# Altium project US-Plus-CPM.PrjPcb (part 2 of 2)

## Sheet Interfaces.SchDoc
size A3; DocumentNumber: 8; SheetNumber: 8; SheetTotal: 9; PageSetup: Record=PageOptions|CenterHorizontal=True|CenterVertical=True|PrintScale=0.97|XCorrection=1.00|YCorrection=1.00|PrintKind=1|BorderSize=5000000|LeftOffset=0|BottomOffset=0|Orientation=2|PaperLength=2970|PaperWidth=2100|Scale=100|PaperSource=7|PrintQuality=600|MediaType=1|DitherType=10|PaperKind=A4|PrintScaleMode=1
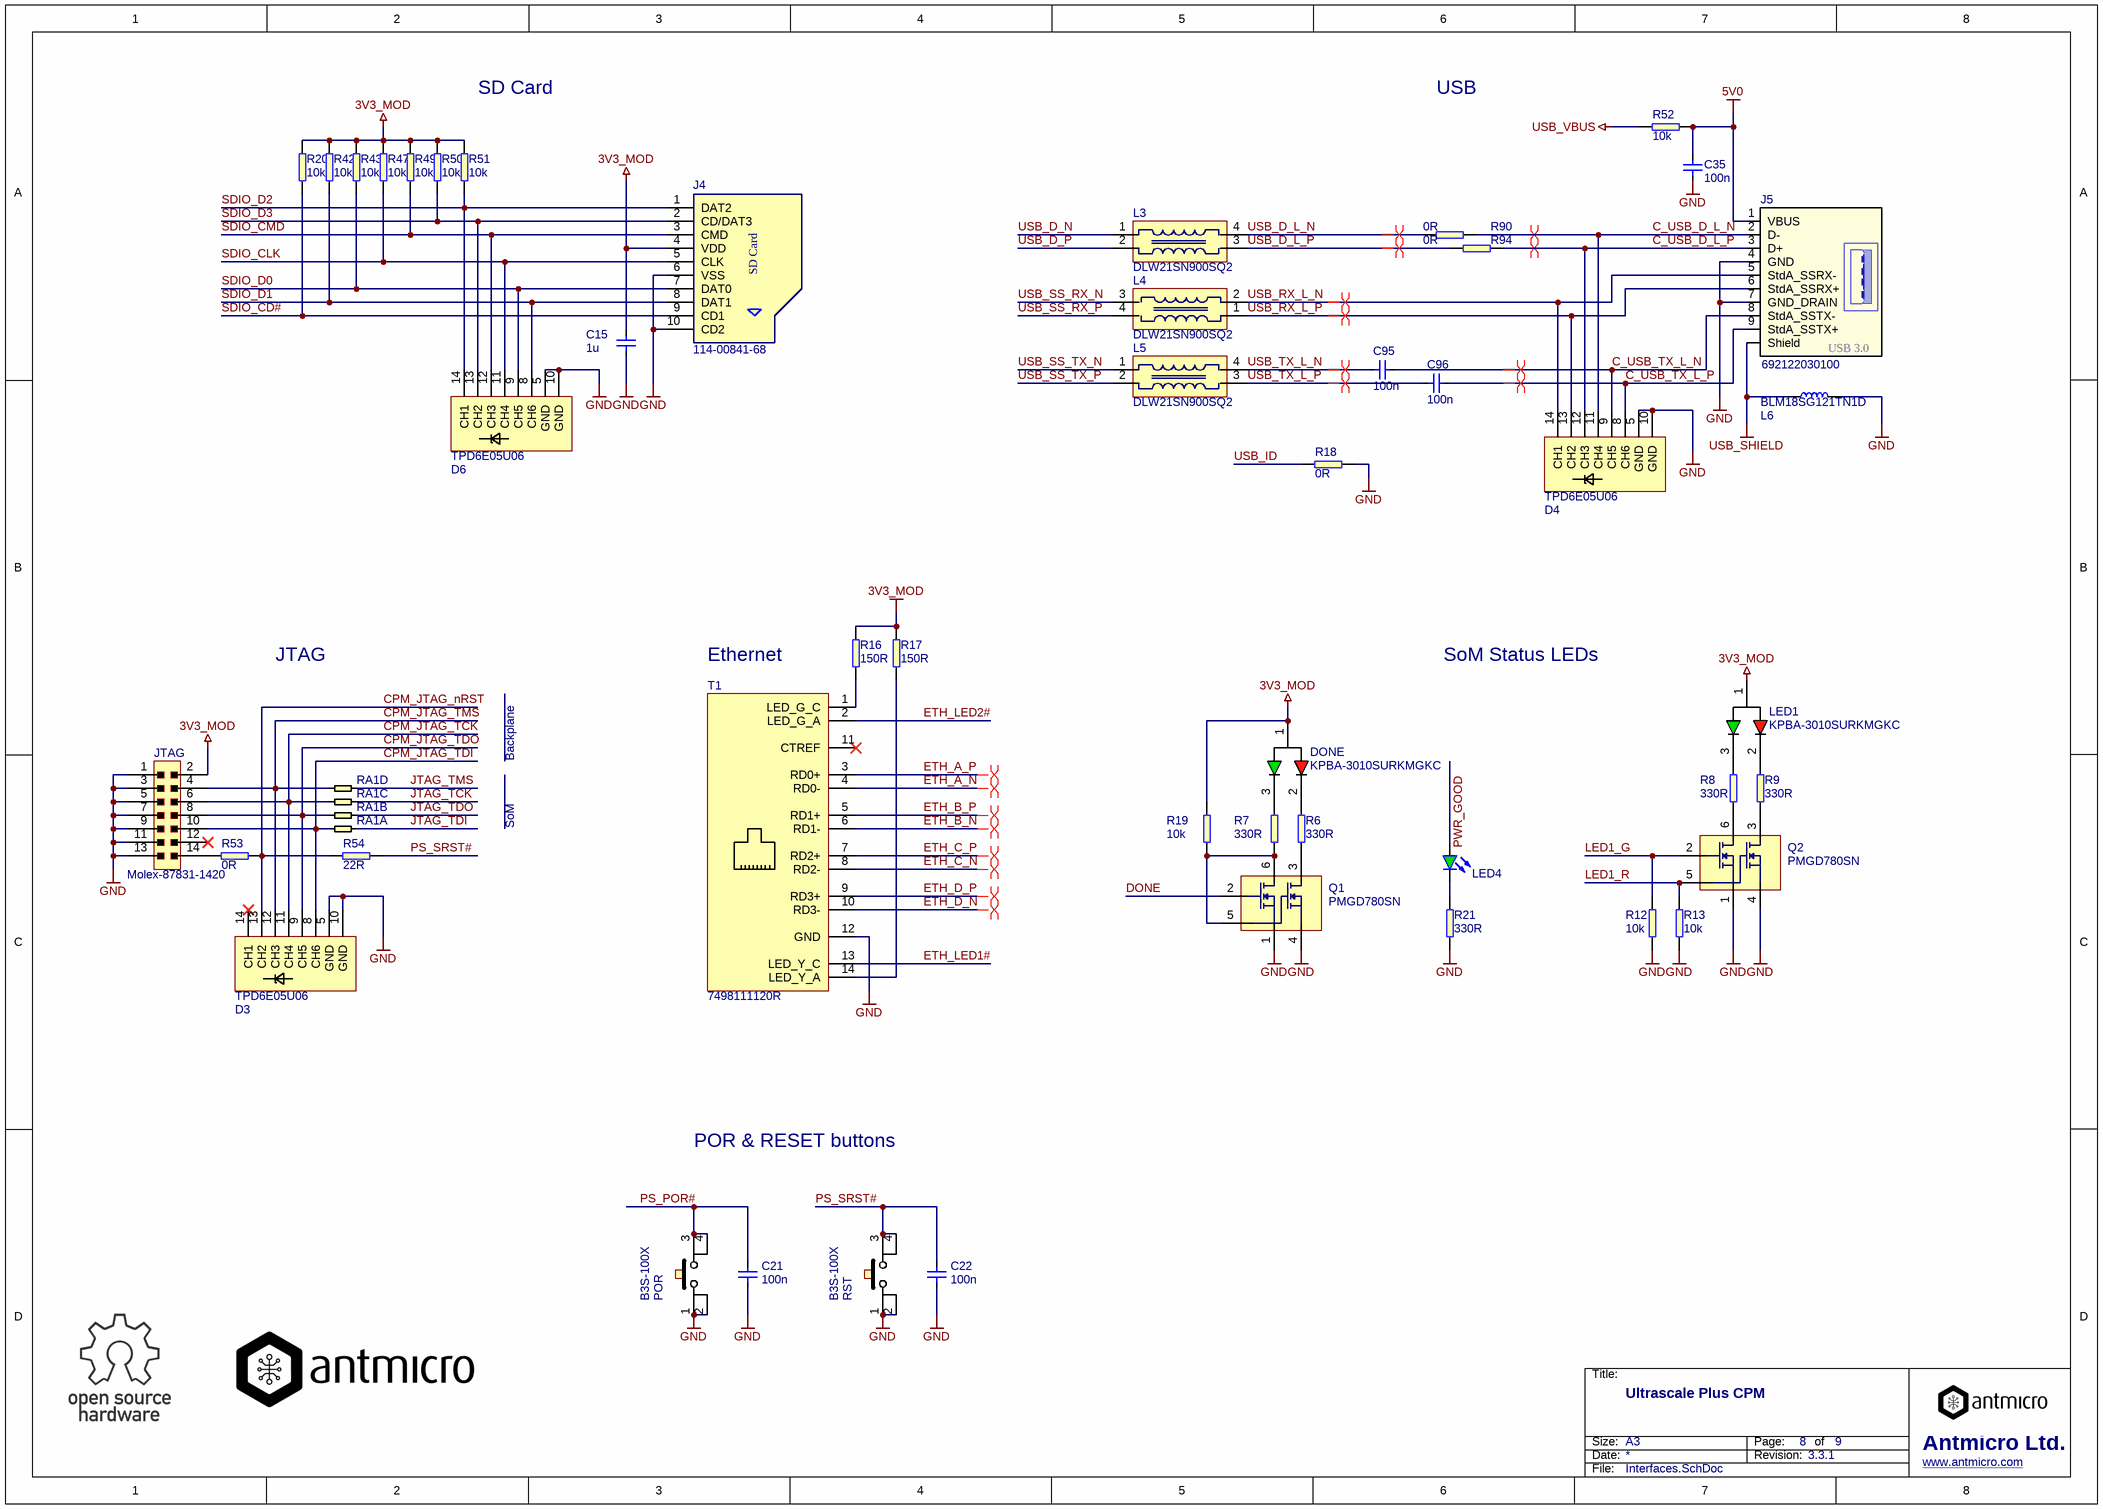
[diagram p7: Interfaces.SchDoc]

### Parts
C15  1u  [0603]
C21  100n  [0603]
C22  100n  [0603]
C35  100n  [0402]
C95  100n  [0402]
C96  100n  [0402]
D3  TPD6E05U06  [TPD6E05U06_PASS]
D4  TPD6E05U06  [TPD6E05U06_PASS]
D6  TPD6E05U06  [TPD6E05U06_PASS]
DONE  KPBA-3010SURKMGKC  [3010SURKMGKC]
J4  114-00841-68  [114-00841-68]
J5  692122030100  [WE_692122030100]
JTAG  Molex-87831-1420  [CON-Molex-87831-1420]
L3  DLW21SN900SQ2  [DLW21SN900SQ2]
L4  DLW21SN900SQ2  [DLW21SN900SQ2]
L5  DLW21SN900SQ2  [DLW21SN900SQ2]
L6  BLM18SG121TN1D  [0603]
LED1  KPBA-3010SURKMGKC  [3010SURKMGKC]
LED4  KPT-1608SGC  [LED0603]  (value not drawn)
POR  B3S-100X  [B3S-100X]
Q1  PMGD780SN  [SOT-363]
Q2  PMGD780SN  [SOT-363]
R6  330R  [0603]
R7  330R  [0603]
R8  330R  [0402]
R9  330R  [0402]
R12  10k  [0402]
R13  10k  [0402]
R16  150R  [0603]
R17  150R  [0603]
R18  0R  [0603]
R19  10k  [0603]
R20  10k  [0402]
R21  330R  [0603]
R42  10k  [0402]
R43  10k  [0402]
R47  10k  [0402]
R49  10k  [0402]
R50  10k  [0402]
R51  10k  [0402]
R52  10k  [0603]
R53  0R  [0603]
R54  22R  [0603]
R90  0R  [0402]
R94  0R  [0402]
RA1  22R  [RA_1206]  (value not drawn)  (parts A,B,C,D of 4)
RST  B3S-100X  [B3S-100X]
T1  7498111120R  [7498111120R]

### Nets
3V3_MOD: C15.2 DONE.1(CA) J4.4(VDD) JTAG.2 LED1.1(CA) R16.2 R17.2 R19.2 R20.2 R42.2 R43.2 R47.2 R49.2 R50.2 R51.2
5V0: C35.2 J5.1(VBUS) R52.2
GND: C15.1 C21.1 C22.1 C35.1 D3.5(GND) D3.10(GND) D4.5(GND) D4.10(GND) D6.5(GND) D6.10(GND) J4.6(VSS) J4.10(CD2) J5.4(GND) J5.7(GND_DRAIN) JTAG.1 JTAG.3 JTAG.5 JTAG.7 JTAG.9 JTAG.11 JTAG.13 L6.2 POR.1 POR.2 Q1.1(S1) Q1.4(S2) Q2.1(S1) Q2.4(S2) R12.1 R13.1 R18.2 R21.2 RST.1 RST.2 T1.12(GND)
USB_SHIELD: J5.Z1(Shield) L6.1
USB_VBUS: R52.1
C_USB_D_L_N: D4.11(CH4) J5.2(D-) R90.2
C_USB_D_L_P: D4.12(CH3) J5.3(D+) R94.2
C_USB_TX_L_N: C95.2 D4.9(CH5) J5.8(StdA_SSTX-)
C_USB_TX_L_P: C96.2 D4.8(CH6) J5.9(StdA_SSTX+)
CPM_JTAG_nRST: D3.13(CH2) R53.2 R54.1
CPM_JTAG_TCK: D3.11(CH4) JTAG.6 RA1.3
CPM_JTAG_TDI: D3.8(CH6) JTAG.10 RA1.1
CPM_JTAG_TDO: D3.9(CH5) JTAG.8 RA1.2
CPM_JTAG_TMS: D3.12(CH3) JTAG.4 RA1.4
DONE: Q1.2(G1)
ETH_A_N: T1.4(RD0-)
ETH_A_P: T1.3(RD0+)
ETH_B_N: T1.6(RD1-)
ETH_B_P: T1.5(RD1+)
ETH_C_N: T1.8(RD2-)
ETH_C_P: T1.7(RD2+)
ETH_D_N: T1.10(RD3-)
ETH_D_P: T1.9(RD3+)
ETH_LED1#: T1.13(LED_Y_C)
ETH_LED2#: T1.2(LED_G_A)
JTAG_TCK: RA1.7
JTAG_TDI: RA1.5
JTAG_TDO: RA1.6
JTAG_TMS: RA1.8
LED1_G: Q2.2(G1) R12.2
LED1_R: Q2.5(G2) R13.2
PS_POR#: C21.2 POR.3 POR.4
PS_SRST#: C22.2 R54.2 RST.3 RST.4
PWR_GOOD: LED4.A
SDIO_CD#: J4.9(CD1) R20.1
SDIO_CLK: D6.11(CH4) J4.5(CLK) R47.1
SDIO_CMD: D6.12(CH3) J4.3(CMD) R49.1
SDIO_D0: D6.9(CH5) J4.7(DAT0) R43.1
SDIO_D1: D6.8(CH6) J4.8(DAT1) R42.1
SDIO_D2: D6.14(CH1) J4.1(DAT2) R51.1
SDIO_D3: D6.13(CH2) J4.2(CD/DAT3) R50.1
USB_D_L_N: L3.4 R90.1
USB_D_L_P: L3.3 R94.1
USB_D_N: L3.1
USB_D_P: L3.2
USB_ID: R18.1
USB_RX_L_N: D4.14(CH1) J5.5(StdA_SSRX-) L4.2
USB_RX_L_P: D4.13(CH2) J5.6(StdA_SSRX+) L4.1
USB_SS_RX_N: L4.3
USB_SS_RX_P: L4.4
USB_SS_TX_N: L5.1
USB_SS_TX_P: L5.2
USB_TX_L_N: C95.1 L5.4
USB_TX_L_P: C96.1 L5.3
NetDONE_2: DONE.2(R_K) R6.1
NetDONE_3: DONE.3(G_K) R7.1
NetJTAG_14: JTAG.14 R53.1
NetLED1_2: LED1.2(R_K) R9.2
NetLED1_3: LED1.3(G_K) R8.2
NetLED4_K: LED4.K R21.1
NetQ1_3: Q1.3(D2) R6.2
NetQ1_5: Q1.5(G2) Q1.6(D1) R7.2 R19.1
NetQ2_3: Q2.3(D2) R9.1
NetQ2_6: Q2.6(D1) R8.1
NetR16_1: R16.1 T1.1(LED_G_C)
NetR17_1: R17.1 T1.14(LED_Y_A)

Not connected (* = marked no-connect by the designer): D3 14(CH1)*; JTAG 12*; T1 11(CTREF)*

### Layout directives
differential pair: C_USB_D_L_N, C_USB_D_L_P, C_USB_TX_L_N, C_USB_TX_L_P, ETH_A_N, ETH_A_P, ETH_B_N, ETH_B_P, ETH_C_N, ETH_C_P, ETH_D_N, ETH_D_P, USB_D_L_N, USB_D_L_P, USB_RX_L_N, USB_RX_L_P, USB_TX_L_N, USB_TX_L_P

### Notes on the sheet
- SD Card
- USB
- JTAG
- Ethernet
- SoM Status LEDs
- Backplane
- SoM
- POR & RESET buttons
- Title:
- Size:
- Date:
- A3
- Revision:
- Page:
- of
- Antmicro Ltd.
- File:
- www.antmicro.com
- (in symbol AMP-114-00841-68) SD Card
- (in symbol WE_692122030100) USB 3.0

### Library data of the parts
C15 = C_1u_0603: MLCC SMT Capacitor 1uF 0603; Manufacturer: MULTICOMP; MPN: MC0603X105M6R3CT; Value: 1u; Part Number: C_1u_0603
C21 C22 = C_100n_0603: as C28 on sheet Display-Port; Value: 100n; Part Number: C_100n_0603
C35 C95 C96 = C_100n_0402: as C1 on sheet Backplane-Connector; Part Number: C_100n_0402; Value: 100n
D3 D4 D6 = TPD6E05U06_PASS: ESD Suppressors 6-CH Pass through layout; Manufacturer: Texas Instruments; MPN: TPD6E05U06RVZR; Part Number: TPD6E05U06_PASS; Value: TPD6E05U06
DONE LED1 = KPBA-3010SURKMGKC: LED SMD 1104 red/green 3x1mm 140° Lens: transparent; Manufacturer: Kingbright; Part Number: KPBA-3010SURKMGKC; Value: KPBA-3010SURKMGKC; MPN: KPBA-3010SURKMGKC
J4 = AMP-114-00841-68: Micro SD card holder; Manufacturer: AMPHENOL COMMERCIAL PRODUCTS; Part Number: AMP-114-00841-68; Value: 114-00841-68; MPN: 114-00841-68
J5 = WE_692122030100: Manufacturer: WURTH ELEKTRONIK; Part Number: WE_692122030100; Value: 692122030100; MPN: 692122030100
JTAG = CON-Molex-87831-1420: HEADER, SQUARE PIN, M/GRID, 14WAY; Manufacturer: MOLEX; Part Number: CON-Molex-87831-1420; Value: Molex-87831-1420; MPN: 87831-1420
L3-L5 = DLW21SN900SQ2: Common mode choke; Manufacturer: MURATA; MPN: DLW21SN900SQ2L; Part Number: DLW21SN900SQ2; Value: DLW21SN900SQ2
L6 = BLM18SG121TN1D: as L9 on sheet Debug; Part Number: BLM18SG121TN1D; Value: BLM18SG121TN1D; MPN: BLM18SG121TN1D
LED4 = LED_G: LED Green 0603 case; Part Number: LED_G; Manufacturer: KINGBRIGHT; Value: KPT-1608SGC; MPN: KPT-1608SGC
POR RST = B3S-100X: Manufacturer: OMRON; MPN: B3S-1002; Part Number: B3S-100X; Value: B3S-100X
Q1 Q2 = PMGD780SN: 60 V, dual N-channel Trench MOSFET; Manufacturer: NXP; MPN: PMGD780SN,115; Part Number: PMGD780SN; Value: PMGD780SN
R6 R7 R21 = R_330R_0603: SMT Resistor 330R 0603; Manufacturer: BOURNS; MPN: CR0603-FX-3300GLF; Value: 330R; Part Number: R_330R_0603
R8 R9 = R_330R_0402: SMT Resistor 0402; Manufacturer: MULTICOMP; MPN: MCMR04X3300FTL; Value: 330R; Part Number: R_330R_0402
R12 R13 R20 R42 R43 R47 R49-R51 = R_10k_0402: as R93 on sheet Debug; Value: 10k; Part Number: R_10k_0402
R16 R17 = R_150R_0603: SMT Resistor 150R 0603; Manufacturer: MULTICOMP; MPN: MC0063W06031150R; Value: 150R; Part Number: R_150R_0603
R18 R53 = R_0R_0603: SMT Resistor 0R 0603; Manufacturer: BOURNS; MPN: CR0603-J/-000ELF; Value: 0R; Part Number: R_0R_0603
R19 R52 = R_10k_0603: SMT Resistor 10k 0603; Manufacturer: BOURNS; MPN: CR0603-JW-103ELF; Value: 10k; Part Number: R_10k_0603
R54 = R_22R_0603: SMT Resistor 22R 0603; Manufacturer: BOURNS; MPN: CR0603-JW-220GLF; Value: 22R; Part Number: R_22R_0603
R90 R94 = R_0R_0402: as R44 on sheet Backplane-Connector; Part Number: R_0R_0402; Value: 0R
RA1 = RA-22R-63mW-5%-1206: YAGEO (PHYCOMP)  TC164-JR-0722RL  RESISTOR ARRAY, ARC241 1206 22R; Part Number: RA-22R-63mW-5%-1206; Value: 22R; Manufacturer: YAGEO (PHYCOMP); MPN: TC164-JR-0722RL
T1 = WE_7498111120R: LAN transformer 1000Base-T; Manufacturer: WURTH ELEKTRONIK; Part Number: WE_7498111120R; Value: 7498111120R; MPN: 7498111120R

## Sheet HDMI.SchDoc
size A3; DocumentNumber: 9; SheetNumber: 9; SheetTotal: 9; PageSetup: Record=PageOptions|CenterHorizontal=True|CenterVertical=True|PrintScale=0.97|XCorrection=1.00|YCorrection=1.00|PrintKind=1|BorderSize=5000000|LeftOffset=0|BottomOffset=0|Orientation=2|PaperLength=2970|PaperWidth=2100|Scale=100|PaperSource=7|PrintQuality=600|MediaType=1|DitherType=10|PaperKind=A4|PrintScaleMode=1
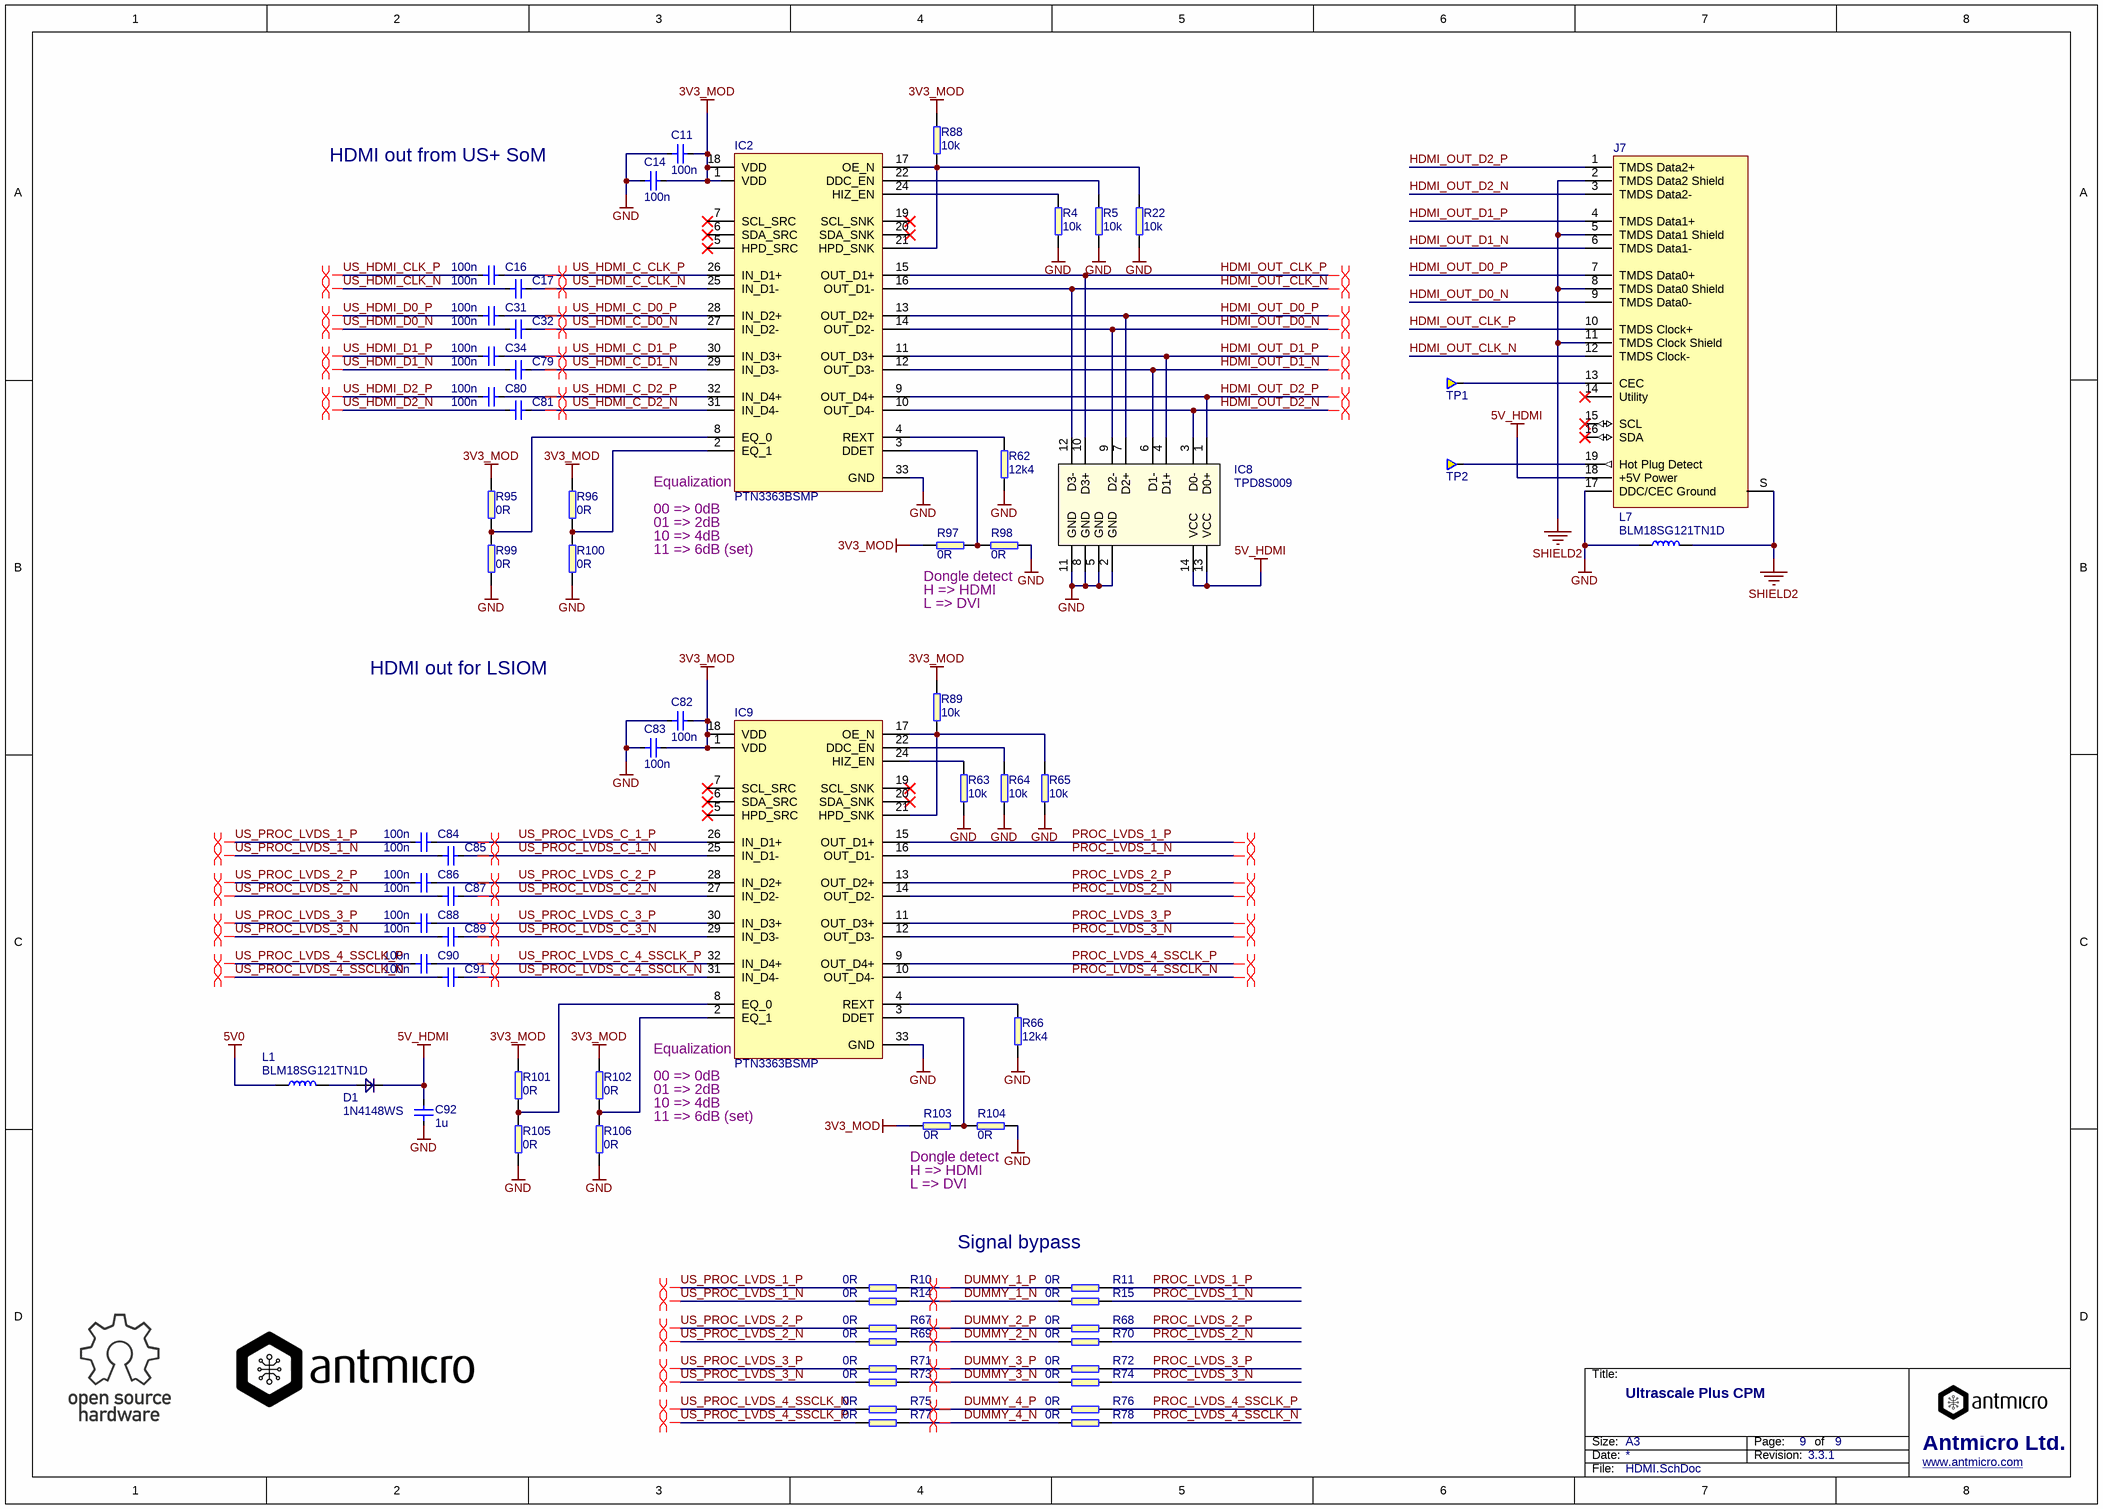
[diagram p8: HDMI.SchDoc]

### Parts
C11  100n  [0603]
C14  100n  [0603]
C16  100n  [0402]
C17  100n  [0402]
C31  100n  [0402]
C32  100n  [0402]
C34  100n  [0402]
C79  100n  [0402]
C80  100n  [0402]
C81  100n  [0402]
C82  100n  [0603]
C83  100n  [0603]
C84  100n  [0402]
C85  100n  [0402]
C86  100n  [0402]
C87  100n  [0402]
C88  100n  [0402]
C89  100n  [0402]
C90  100n  [0402]
C91  100n  [0402]
C92  1u  [0603]
D1  1N4148WS  [SOD-323]
IC2  PTN3363BSMP  [QFN-32]
IC8  TPD8S009  [SON-15]
IC9  PTN3363BSMP  [QFN-32]
J7  (no value)  [Molex_HDMI_471511001]
L1  BLM18SG121TN1D  [0603]
L7  BLM18SG121TN1D  [0603]
R4  10k  [0402]
R5  10k  [0402]
R10  0R  [0402]
R11  0R  [0402]
R14  0R  [0402]
R15  0R  [0402]
R22  10k  [0402]
R62  12k4  [0603]
R63  10k  [0402]
R64  10k  [0402]
R65  10k  [0402]
R66  12k4  [0603]
R67  0R  [0402]
R68  0R  [0402]
R69  0R  [0402]
R70  0R  [0402]
R71  0R  [0402]
R72  0R  [0402]
R73  0R  [0402]
R74  0R  [0402]
R75  0R  [0402]
R76  0R  [0402]
R77  0R  [0402]
R78  0R  [0402]
R88  10k  [0402]
R89  10k  [0402]
R95  0R  [0402]
R96  0R  [0402]
R97  0R  [0402]
R98  0R  [0402]
R99  0R  [0402]
R100  0R  [0402]
R101  0R  [0402]
R102  0R  [0402]
R103  0R  [0402]
R104  0R  [0402]
R105  0R  [0402]
R106  0R  [0402]
TP1  *  [Testpad]  (value not drawn)  (no BOM)
TP2  *  [Testpad]  (value not drawn)  (no BOM)

### Nets
3V3_MOD: C11.2 C14.2 C82.2 C83.2 IC2.1(VDD) IC2.18(VDD) IC9.1(VDD) IC9.18(VDD) R88.1 R89.1 R95.2 R96.2 R97.2 R101.2 R102.2 R103.2
5V0: L1.1
5V_HDMI: C92.2 D1.C IC8.13(VCC) IC8.14(VCC) J7.18(+5V_Power)
GND: C11.1 C14.1 C82.1 C83.1 C92.1 IC2.33(GND) IC8.2(GND) IC8.5(GND) IC8.8(GND) IC8.11(GND) IC9.33(GND) J7.17(DDC/CEC_Ground) L7.1 R4.2 R5.2 R22.2 R62.1 R63.2 R64.2 R65.2 R66.1 R98.1 R99.1 R100.1 R104.1 R105.1 R106.1
SHIELD2: J7.2(TMDS_Data2_Shield) J7.5(TMDS_Data1_Shield) J7.8(TMDS_Data0_Shield) J7.11(TMDS_Clock_Shield) J7.S(SH) L7.2
DUMMY_1_N: R14.2 R15.1
DUMMY_1_P: R10.2 R11.1
DUMMY_2_N: R69.2 R70.1
DUMMY_2_P: R67.2 R68.1
DUMMY_3_N: R73.2 R74.1
DUMMY_3_P: R71.2 R72.1
DUMMY_4_N: R77.2 R78.1
DUMMY_4_P: R75.2 R76.1
HDMI_OUT_CLK_N: IC2.16(OUT_D1-) IC8.12(D3-) J7.12(TMDS_Clock-)
HDMI_OUT_CLK_P: IC2.15(OUT_D1+) IC8.10(D3+) J7.10(TMDS_Clock+)
HDMI_OUT_D0_N: IC2.14(OUT_D2-) IC8.9(D2-) J7.9(TMDS_Data0-)
HDMI_OUT_D0_P: IC2.13(OUT_D2+) IC8.7(D2+) J7.7(TMDS_Data0+)
HDMI_OUT_D1_N: IC2.12(OUT_D3-) IC8.6(D1-) J7.6(TMDS_Data1-)
HDMI_OUT_D1_P: IC2.11(OUT_D3+) IC8.4(D1+) J7.4(TMDS_Data1+)
HDMI_OUT_D2_N: IC2.10(OUT_D4-) IC8.3(D0-) J7.3(TMDS_Data2-)
HDMI_OUT_D2_P: IC2.9(OUT_D4+) IC8.1(D0+) J7.1(TMDS_Data2+)
PROC_LVDS_1_N: IC9.16(OUT_D1-) R15.2
PROC_LVDS_1_P: IC9.15(OUT_D1+) R11.2
PROC_LVDS_2_N: IC9.14(OUT_D2-) R70.2
PROC_LVDS_2_P: IC9.13(OUT_D2+) R68.2
PROC_LVDS_3_N: IC9.12(OUT_D3-) R74.2
PROC_LVDS_3_P: IC9.11(OUT_D3+) R72.2
PROC_LVDS_4_SSCLK_N: IC9.10(OUT_D4-) R78.2
PROC_LVDS_4_SSCLK_P: IC9.9(OUT_D4+) R76.2
US_HDMI_C_CLK_N: C17.2 IC2.25(IN_D1-)
US_HDMI_C_CLK_P: C16.2 IC2.26(IN_D1+)
US_HDMI_C_D0_N: C32.2 IC2.27(IN_D2-)
US_HDMI_C_D0_P: C31.2 IC2.28(IN_D2+)
US_HDMI_C_D1_N: C79.2 IC2.29(IN_D3-)
US_HDMI_C_D1_P: C34.2 IC2.30(IN_D3+)
US_HDMI_C_D2_N: C81.2 IC2.31(IN_D4-)
US_HDMI_C_D2_P: C80.2 IC2.32(IN_D4+)
US_HDMI_CLK_N: C17.1
US_HDMI_CLK_P: C16.1
US_HDMI_D0_N: C32.1
US_HDMI_D0_P: C31.1
US_HDMI_D1_N: C79.1
US_HDMI_D1_P: C34.1
US_HDMI_D2_N: C81.1
US_HDMI_D2_P: C80.1
US_PROC_LVDS_1_N: C85.1 R14.1
US_PROC_LVDS_1_P: C84.1 R10.1
US_PROC_LVDS_2_N: C87.1 R69.1
US_PROC_LVDS_2_P: C86.1 R67.1
US_PROC_LVDS_3_N: C89.1 R73.1
US_PROC_LVDS_3_P: C88.1 R71.1
US_PROC_LVDS_4_SSCLK_N: C91.1 R75.1
US_PROC_LVDS_4_SSCLK_P: C90.1 R77.1
US_PROC_LVDS_C_1_N: C85.2 IC9.25(IN_D1-)
US_PROC_LVDS_C_1_P: C84.2 IC9.26(IN_D1+)
US_PROC_LVDS_C_2_N: C87.2 IC9.27(IN_D2-)
US_PROC_LVDS_C_2_P: C86.2 IC9.28(IN_D2+)
US_PROC_LVDS_C_3_N: C89.2 IC9.29(IN_D3-)
US_PROC_LVDS_C_3_P: C88.2 IC9.30(IN_D3+)
US_PROC_LVDS_C_4_SSCLK_N: C91.2 IC9.31(IN_D4-)
US_PROC_LVDS_C_4_SSCLK_P: C90.2 IC9.32(IN_D4+)
NetD1_A: D1.A L1.2
NetIC2_2: IC2.2(EQ_1) R96.1 R100.2
NetIC2_3: IC2.3(DDET) R97.1 R98.2
NetIC2_4: IC2.4(REXT) R62.2
NetIC2_8: IC2.8(EQ_0) R95.1 R99.2
NetIC2_17: IC2.17(OE_N) IC2.21(HPD_SNK) R22.1 R88.2
NetIC2_22: IC2.22(DDC_EN) R5.1
NetIC2_24: IC2.24(HIZ_EN) R4.1
NetIC9_2: IC9.2(EQ_1) R102.1 R106.2
NetIC9_3: IC9.3(DDET) R103.1 R104.2
NetIC9_4: IC9.4(REXT) R66.2
NetIC9_8: IC9.8(EQ_0) R101.1 R105.2
NetIC9_17: IC9.17(OE_N) IC9.21(HPD_SNK) R65.1 R89.2
NetIC9_22: IC9.22(DDC_EN) R64.1
NetIC9_24: IC9.24(HIZ_EN) R63.1
NetJ7_13: J7.13(CEC) TP1.1
NetJ7_19: J7.19(Hot_Plug_Detect) TP2.1

Not connected (* = marked no-connect by the designer): IC2 5(HPD_SRC)* 6(SDA_SRC)* 7(SCL_SRC)* 19(SCL_SNK)* 20(SDA_SNK)*; IC9 5(HPD_SRC)* 6(SDA_SRC)* 7(SCL_SRC)* 19(SCL_SNK)* 20(SDA_SNK)*; J7 14(Utility)* 15(SCL)* 16(SDA)*

### Layout directives
differential pair: DUMMY_1_N, DUMMY_1_P, DUMMY_2_N, DUMMY_2_P, DUMMY_3_N, DUMMY_3_P, DUMMY_4_N, DUMMY_4_P, HDMI_OUT_CLK_N, HDMI_OUT_CLK_P, HDMI_OUT_D0_N, HDMI_OUT_D0_P, HDMI_OUT_D1_N, HDMI_OUT_D1_P, HDMI_OUT_D2_N, HDMI_OUT_D2_P, PROC_LVDS_1_N, PROC_LVDS_1_P, PROC_LVDS_2_N, PROC_LVDS_2_P, PROC_LVDS_3_N, PROC_LVDS_3_P, PROC_LVDS_4_SSCLK_N, PROC_LVDS_4_SSCLK_P, US_HDMI_C_CLK_N, US_HDMI_C_CLK_P, US_HDMI_C_D0_N, US_HDMI_C_D0_P, US_HDMI_C_D1_N, US_HDMI_C_D1_P, US_HDMI_C_D2_N, US_HDMI_C_D2_P, US_HDMI_CLK_N, US_HDMI_CLK_P, US_HDMI_D0_N, US_HDMI_D0_P, US_HDMI_D1_N, US_HDMI_D1_P, US_HDMI_D2_N, US_HDMI_D2_P, US_PROC_LVDS_1_N, US_PROC_LVDS_1_P, US_PROC_LVDS_2_N, US_PROC_LVDS_2_P, US_PROC_LVDS_3_N, US_PROC_LVDS_3_P, US_PROC_LVDS_4_SSCLK_N, US_PROC_LVDS_4_SSCLK_P, US_PROC_LVDS_C_1_N, US_PROC_LVDS_C_1_P, US_PROC_LVDS_C_2_N, US_PROC_LVDS_C_2_P, US_PROC_LVDS_C_3_N, US_PROC_LVDS_C_3_P, US_PROC_LVDS_C_4_SSCLK_N, US_PROC_LVDS_C_4_SSCLK_P

### Notes on the sheet
- HDMI out from US+ SoM
- (near IC2) 00 => 0dB
- (near IC2) Equalization
- (near IC2) 01 => 2dB
- 10 => 4dB
- 11 => 6dB (set)
- Dongle detect
- H => HDMI
- L => DVI
- HDMI out for LSIOM
- (near IC9) Equalization
- (near IC9) 00 => 0dB
- 01 => 2dB
- Signal bypass
- Title:
- Size:
- Date:
- A3
- Revision:
- Page:
- of
- Antmicro Ltd.
- File:
- www.antmicro.com

### Library data of the parts
C11 C14 C82 C83 = C_100n_0603: MLCC SMT Capacitor 100nF 0603; Manufacturer: WALSIN; MPN: 0603B104K500CT; Value: 100n; Part Number: C_100n_0603
C16 C17 C31 C32 C34 C79-C81 C84-C91 = C_100n_0402: MLCC SMT Capacitor 100nF 0402; Manufacturer: MULTICOMP; MPN: MC0402X104M100CT; Value: 100n; Part Number: C_100n_0402
C92 = C_1u_0603: MLCC SMT Capacitor 1uF 0603; Manufacturer: MULTICOMP; MPN: MC0603X105M6R3CT; Value: 1u; Part Number: C_1u_0603
D1 = 1N4148WS: Diode small signal; Manufacturer: MULTICOMP; Part Number: 1N4148WS; Value: 1N4148WS; MPN: 1N4148WS
IC2 IC9 = PTN3363BSMP: HDMI level shifter; Manufacturer: NXP; Part Number: PTN3363BSMP; Value: PTN3363BSMP; MPN: PTN3363BSMP
IC8 = TPD8S009: 8-Channel ESD Protection for DisplayPort and HDMI; Manufacturer: TEXAS INSTRUMENTS; MPN: TPD8S009DSMR; Part Number: TPD8S009; Value: TPD8S009
J7 = CON-Molex-471511001: Header right angle HDMI; Manufacturer: MOLEX; MPN: 47151-1001; Part Number: CON-Molex-471511001
L1 L7 = BLM18SG121TN1D: FERRITE BEAD, 0.025OHM, 3A, 0603; Manufacturer: MURATA; Part Number: BLM18SG121TN1D; Value: BLM18SG121TN1D; MPN: BLM18SG121TN1D
R4 R5 R22 R63-R65 R88 R89 = R_10k_0402: SMT Resistor 0402; Manufacturer: MULTICOMP; MPN: MCMR04X1002FTL; Value: 10k; Part Number: R_10k_0402
R10 R11 R14 R15 R67-R78 R95-R106 = R_0R_0402: SMT Resistor 0402; Manufacturer: MULTICOMP; MPN: MCMR04X000 PTL; Part Number: R_0R_0402; Value: 0R
R62 R66 = R_12k4_0603_1%: SMT Resistor 12k4 0603 1%; Manufacturer: Vishay; MPN: CRCW060312K4FKEA; Value: 12k4; Part Number: R_12k4_0603_1%
TP1 TP2 = Testpad: Testpad 2mm diameter; Part Number: Testpad

## Nets that join several sheets
1V8_MOD: SoM-Connectors (10 pins), SoM-MGTH (6 pins), Sensor-Connector (J2.105 J2.107), Display-Port (C28.2 IC12.1 IC12.8)
3V3_MOD: SoM-Connectors (8 pins), Backplane-Connector (C9.2 IC1.1 IC1.8), SoM-MGTH (C18.2 IC6.1 IC6.6), Display-Port (10 pins), Interfaces (15 pins), HDMI (16 pins)
5V0: Supplies (C27.2 C52.2 IC7.2 IC7.4), Debug (D9.A), Interfaces (C35.2 J5.1 R52.2), HDMI (L1.1)
GND: Supplies (19 pins), SoM-Connectors (67 pins), Backplane-Connector (67 pins), SoM-MGTH (43 pins), Sensor-Connector (14 pins), Display-Port (24 pins), Debug (26 pins), Interfaces (35 pins), HDMI (27 pins)
USB_VBUS: SoM-Connectors (M1.131), Interfaces (R52.1)
VBAT: Supplies (BAT.+), SoM-Connectors (M1.168)
VCC_3.3_PRSNT: Supplies (R59.1), Backplane-Connector (C10.2 IC1.14 J1.A1)
VCC_7.4_CPM: Supplies (9 pins), Backplane-Connector (7 pins), Sensor-Connector (J2.1 J2.3)
VCC_MOD: Supplies (10 pins), SoM-Connectors (10 pins)
BS0: SoM-Connectors (M1.84), Backplane-Connector (R2.7)
BS1: SoM-Connectors (M1.82), Backplane-Connector (R2.5)
CLK_IN_1: SoM-MGTH (M3.77), Sensor-Connector (J2.7)
CLK_IN_2: SoM-MGTH (M3.75), Sensor-Connector (J2.5)
CPM_BS2: SoM-Connectors (M1.78), Backplane-Connector (R107.2)
CPM_BS3: SoM-Connectors (M1.76), Backplane-Connector (R109.2)
CPM_JTAG_nRST: Backplane-Connector (J1.A3), Interfaces (D3.13 R53.2 R54.1)
CPM_JTAG_TCK: Backplane-Connector (J1.A5), Interfaces (D3.11 JTAG.6 RA1.3)
CPM_JTAG_TDI: Backplane-Connector (J1.A7), Interfaces (D3.8 JTAG.10 RA1.1)
CPM_JTAG_TDO: Backplane-Connector (J1.A9), Interfaces (D3.9 JTAG.8 RA1.2)
CPM_JTAG_TMS: Backplane-Connector (J1.A11), Interfaces (D3.12 JTAG.4 RA1.4)
DONE: SoM-Connectors (M1.130), Interfaces (Q1.2)
DP0_C2M_N: Backplane-Connector (C8.2), SoM-MGTH (M3.17)
DP0_C2M_P: Backplane-Connector (C7.2), SoM-MGTH (M3.13)
DP0_M2C_N: Backplane-Connector (J1.B16), SoM-MGTH (M3.20)
DP0_M2C_P: Backplane-Connector (J1.B15), SoM-MGTH (M3.16)
DP1_C2M_N: Backplane-Connector (C6.2), SoM-MGTH (M3.25)
DP1_C2M_P: Backplane-Connector (C5.2), SoM-MGTH (M3.21)
DP1_M2C_N: Backplane-Connector (J1.B20), SoM-MGTH (M3.28)
DP1_M2C_P: Backplane-Connector (J1.B19), SoM-MGTH (M3.24)
DP2_C2M_N: Backplane-Connector (C4.2), SoM-MGTH (M3.33)
DP2_C2M_P: Backplane-Connector (C3.2), SoM-MGTH (M3.29)
DP2_M2C_N: Backplane-Connector (J1.B24), SoM-MGTH (M3.36)
DP2_M2C_P: Backplane-Connector (J1.B23), SoM-MGTH (M3.32)
DP3_C2M_N: Backplane-Connector (C2.2), SoM-MGTH (M3.41)
DP3_C2M_P: Backplane-Connector (C1.2), SoM-MGTH (M3.37)
DP3_M2C_N: Backplane-Connector (J1.B28), SoM-MGTH (M3.44)
DP3_M2C_P: Backplane-Connector (J1.B27), SoM-MGTH (M3.40)
DP_AUX_IN_M: SoM-Connectors (M2.129), Display-Port (IC12.5)
DP_AUX_OE_M: SoM-Connectors (M2.131), Display-Port (IC12.4)
DP_AUX_OUT_M: SoM-Connectors (M2.135), Display-Port (IC12.2)
DP_HPD_M: SoM-Connectors (M2.133), Display-Port (IC12.3)
ETH_A_N: SoM-Connectors (M1.163), Interfaces (T1.4)
ETH_A_P: SoM-Connectors (M1.165), Interfaces (T1.3)
ETH_B_N: SoM-Connectors (M1.157), Interfaces (T1.6)
ETH_B_P: SoM-Connectors (M1.159), Interfaces (T1.5)
ETH_C_N: SoM-Connectors (M1.151), Interfaces (T1.8)
ETH_C_P: SoM-Connectors (M1.153), Interfaces (T1.7)
ETH_D_N: SoM-Connectors (M1.145), Interfaces (T1.10)
ETH_D_P: SoM-Connectors (M1.147), Interfaces (T1.9)
ETH_LED1#: SoM-Connectors (M1.149), Interfaces (T1.13)
ETH_LED2#: SoM-Connectors (M1.161), Interfaces (T1.2)
FRAME_REQ_S1: SoM-MGTH (M3.101), Sensor-Connector (J2.46)
FRAME_REQ_S2: SoM-MGTH (M3.89), Sensor-Connector (J2.21)
FT_BS2: Backplane-Connector (R107.1 R108.2), Debug (IC3.39)
FT_BS3: Backplane-Connector (R109.1 R110.2), Debug (IC3.40)
GT0_DP_TX_N: SoM-Connectors (M2.17), Display-Port (C43.1)
GT0_DP_TX_P: SoM-Connectors (M2.13), Display-Port (C42.1)
GT1_DP_TX_N: SoM-Connectors (M2.25), Display-Port (C40.1)
GT1_DP_TX_P: SoM-Connectors (M2.21), Display-Port (C39.1)
JTAG_TCK: SoM-Connectors (M1.123), Interfaces (RA1.7)
JTAG_TDI: SoM-Connectors (M1.117), Interfaces (RA1.5)
JTAG_TDO: SoM-Connectors (M1.121), Interfaces (RA1.6)
JTAG_TMS: SoM-Connectors (M1.119), Interfaces (RA1.8)
LED1_G: SoM-Connectors (M1.70), Interfaces (Q2.2 R12.2)
LED1_R: SoM-Connectors (M1.72), Interfaces (Q2.5 R13.2)
LVDS_CLK_S1_N: SoM-MGTH (M3.87), Sensor-Connector (J2.19)
LVDS_CLK_S1_P: SoM-MGTH (M3.85), Sensor-Connector (J2.17)
LVDS_CLK_S2_N: SoM-MGTH (M3.81), Sensor-Connector (J2.13)
LVDS_CLK_S2_P: SoM-MGTH (M3.79), Sensor-Connector (J2.11)
LVDS_S1_CTRL_N: SoM-MGTH (M3.141), Sensor-Connector (J2.78)
LVDS_S1_CTRL_P: SoM-MGTH (M3.139), Sensor-Connector (J2.76)
LVDS_S1_D1_N: SoM-MGTH (M3.140), Sensor-Connector (J2.75)
LVDS_S1_D1_P: SoM-MGTH (M3.138), Sensor-Connector (J2.73)
LVDS_S1_D2_N: SoM-MGTH (M3.137), Sensor-Connector (J2.74)
LVDS_S1_D2_P: SoM-MGTH (M3.135), Sensor-Connector (J2.72)
LVDS_S1_D3_N: SoM-MGTH (M3.150), Sensor-Connector (J2.83)
LVDS_S1_D3_P: SoM-MGTH (M3.148), Sensor-Connector (J2.81)
LVDS_S1_D4_N: SoM-MGTH (M3.144), Sensor-Connector (J2.79)
LVDS_S1_D4_P: SoM-MGTH (M3.142), Sensor-Connector (J2.77)
LVDS_S1_D5_N: SoM-MGTH (M3.131), Sensor-Connector (J2.70)
LVDS_S1_D5_P: SoM-MGTH (M3.129), Sensor-Connector (J2.68)
LVDS_S1_D6_N: SoM-MGTH (M3.124), Sensor-Connector (J2.63)
LVDS_S1_D6_P: SoM-MGTH (M3.122), Sensor-Connector (J2.61)
LVDS_S1_D7_N: SoM-MGTH (M3.134), Sensor-Connector (J2.71)
LVDS_S1_D7_P: SoM-MGTH (M3.132), Sensor-Connector (J2.69)
LVDS_S1_D8_N: SoM-MGTH (M3.156), Sensor-Connector (J2.87)
LVDS_S1_D8_P: SoM-MGTH (M3.154), Sensor-Connector (J2.85)
LVDS_S1_D9_N: SoM-MGTH (M3.110), Sensor-Connector (J2.51)
LVDS_S1_D9_P: SoM-MGTH (M3.108), Sensor-Connector (J2.49)
LVDS_S1_D10_N: SoM-MGTH (M3.130), Sensor-Connector (J2.67)
LVDS_S1_D10_P: SoM-MGTH (M3.128), Sensor-Connector (J2.65)
LVDS_S1_D11_N: SoM-MGTH (M3.120), Sensor-Connector (J2.59)
LVDS_S1_D11_P: SoM-MGTH (M3.118), Sensor-Connector (J2.57)
LVDS_S1_D12_N: SoM-MGTH (M3.127), Sensor-Connector (J2.66)
LVDS_S1_D12_P: SoM-MGTH (M3.125), Sensor-Connector (J2.64)
LVDS_S1_D13_N: SoM-MGTH (M3.117), Sensor-Connector (J2.58)
LVDS_S1_D13_P: SoM-MGTH (M3.115), Sensor-Connector (J2.56)
LVDS_S1_D14_N: SoM-MGTH (M3.107), Sensor-Connector (J2.50)
LVDS_S1_D14_P: SoM-MGTH (M3.105), Sensor-Connector (J2.48)
LVDS_S1_D15_N: SoM-MGTH (M3.121), Sensor-Connector (J2.62)
LVDS_S1_D15_P: SoM-MGTH (M3.119), Sensor-Connector (J2.60)
LVDS_S1_D16_N: SoM-MGTH (M3.114), Sensor-Connector (J2.55)
LVDS_S1_D16_P: SoM-MGTH (M3.112), Sensor-Connector (J2.53)
LVDS_S1_OUTCLK_N: SoM-MGTH (M3.111), Sensor-Connector (J2.54)
LVDS_S1_OUTCLK_P: SoM-MGTH (M3.109), Sensor-Connector (J2.52)
LVDS_S2_CTRL_N: SoM-Connectors (M2.156), Sensor-Connector (J2.39)
LVDS_S2_CTRL_P: SoM-Connectors (M2.154), Sensor-Connector (J2.37)
LVDS_S2_D1_N: SoM-MGTH (M3.94), Sensor-Connector (J2.108)
LVDS_S2_D1_P: SoM-MGTH (M3.92), Sensor-Connector (J2.106)
LVDS_S2_D2_N: SoM-Connectors (M2.150), Sensor-Connector (J2.35)
LVDS_S2_D2_P: SoM-Connectors (M2.148), Sensor-Connector (J2.33)
LVDS_S2_D3_N: SoM-MGTH (M3.100), Sensor-Connector (J2.114)
LVDS_S2_D3_P: SoM-MGTH (M3.98), Sensor-Connector (J2.112)
LVDS_S2_D4_N: SoM-Connectors (M2.162), Sensor-Connector (J2.43)
LVDS_S2_D4_P: SoM-Connectors (M2.160), Sensor-Connector (J2.41)
LVDS_S2_D5_N: SoM-Connectors (M2.144), Sensor-Connector (J2.31)
LVDS_S2_D5_P: SoM-Connectors (M2.142), Sensor-Connector (J2.29)
LVDS_S2_D6_N: SoM-MGTH (M3.90), Sensor-Connector (J2.104)
LVDS_S2_D6_P: SoM-MGTH (M3.88), Sensor-Connector (J2.102)
LVDS_S2_D7_N: Backplane-Connector (R87.1), Sensor-Connector (J2.34)
LVDS_S2_D7_P: Backplane-Connector (R86.1), Sensor-Connector (J2.32)
LVDS_S2_D8_N: SoM-MGTH (M3.104), Sensor-Connector (J2.118)
LVDS_S2_D8_P: SoM-MGTH (M3.102), Sensor-Connector (J2.116)
LVDS_S2_D9_N: SoM-MGTH (M3.84), Sensor-Connector (J2.100)
LVDS_S2_D9_P: SoM-MGTH (M3.82), Sensor-Connector (J2.98)
LVDS_S2_D10_N: Backplane-Connector (R83.1), Sensor-Connector (J2.30)
LVDS_S2_D10_P: Backplane-Connector (R82.1), Sensor-Connector (J2.28)
LVDS_S2_D11_N: SoM-MGTH (M3.80), Sensor-Connector (J2.96)
LVDS_S2_D11_P: SoM-MGTH (M3.78), Sensor-Connector (J2.94)
LVDS_S2_D12_N: SoM-Connectors (M2.138), Sensor-Connector (J2.27)
LVDS_S2_D12_P: SoM-Connectors (M2.136), Sensor-Connector (J2.25)
LVDS_S2_D13_N: Backplane-Connector (R81.1), Sensor-Connector (J2.26)
LVDS_S2_D13_P: Backplane-Connector (R80.1), Sensor-Connector (J2.24)
LVDS_S2_D14_N: Backplane-Connector (R85.1), Sensor-Connector (J2.10)
LVDS_S2_D14_P: Backplane-Connector (R84.1), Sensor-Connector (J2.8)
LVDS_S2_D15_N: Backplane-Connector (R56.1), Sensor-Connector (J2.14)
LVDS_S2_D15_P: Backplane-Connector (R48.1), Sensor-Connector (J2.12)
LVDS_S2_D16_N: SoM-Connectors (M2.166), Sensor-Connector (J2.47)
LVDS_S2_D16_P: SoM-Connectors (M2.164), Sensor-Connector (J2.45)
LVDS_S2_OUTCLK_N: Backplane-Connector (R79.1), Sensor-Connector (J2.22)
LVDS_S2_OUTCLK_P: Backplane-Connector (R61.1), Sensor-Connector (J2.20)
MODULE_ON: Supplies (R59.2), Backplane-Connector (J1.B81 R1.2)
PREPROC_LVDS_0_N: SoM-Connectors (M2.74), Backplane-Connector (C73.2)
PREPROC_LVDS_0_P: SoM-Connectors (M2.72), Backplane-Connector (C72.2)
PREPROC_LVDS_1_N: SoM-Connectors (M2.86), Backplane-Connector (C71.2)
PREPROC_LVDS_1_P: SoM-Connectors (M2.84), Backplane-Connector (C70.2)
PREPROC_LVDS_2_N: SoM-Connectors (M2.92), Backplane-Connector (C69.2)
PREPROC_LVDS_2_P: SoM-Connectors (M2.90), Backplane-Connector (C68.2)
PREPROC_LVDS_3_N: SoM-Connectors (M2.96), Backplane-Connector (C67.2 R87.2)
PREPROC_LVDS_3_P: SoM-Connectors (M2.94), Backplane-Connector (C66.2 R86.2)
PREPROC_LVDS_4_SSCLK_N: SoM-Connectors (M2.80), Backplane-Connector (C65.2)
PREPROC_LVDS_4_SSCLK_P: SoM-Connectors (M2.78), Backplane-Connector (C64.2)
PREPROC_LVDS_5_N: SoM-Connectors (M2.102), Backplane-Connector (C63.2 R83.2)
PREPROC_LVDS_5_P: SoM-Connectors (M2.100), Backplane-Connector (C62.2 R82.2)
PREPROC_LVDS_6_N: SoM-Connectors (M2.106), Backplane-Connector (C61.2 R81.2)
PREPROC_LVDS_6_P: SoM-Connectors (M2.104), Backplane-Connector (C60.2 R80.2)
PREPROC_LVDS_7_N: SoM-Connectors (M2.112), Backplane-Connector (C36.2 R60.2)
PREPROC_LVDS_7_P: SoM-Connectors (M2.110), Backplane-Connector (C33.2 R57.2)
PREPROC_LVDS_8_N: SoM-Connectors (M2.116), Backplane-Connector (C20.2 R56.2)
PREPROC_LVDS_8_P: SoM-Connectors (M2.114), Backplane-Connector (C19.2 R48.2)
PREPROC_LVDS_9_N: SoM-Connectors (M2.122), Backplane-Connector (C13.2 R85.2)
PREPROC_LVDS_9_P: SoM-Connectors (M2.120), Backplane-Connector (C12.2 R84.2)
PREPROC_LVDS_10_N: SoM-Connectors (M2.126), Backplane-Connector (J1.B44 R46.2)
PREPROC_LVDS_10_P: SoM-Connectors (M2.124), Backplane-Connector (J1.B43 R44.2)
PREPROC_LVDS_11_N: SoM-Connectors (M2.141), Backplane-Connector (J1.A42)
PREPROC_LVDS_11_P: SoM-Connectors (M2.139), Backplane-Connector (J1.A41)
PREPROC_LVDS_12_N: SoM-Connectors (M2.147), Backplane-Connector (J1.A38)
PREPROC_LVDS_12_P: SoM-Connectors (M2.145), Backplane-Connector (J1.A37)
PREPROC_LVDS_13_N: SoM-Connectors (M2.153), Backplane-Connector (J1.A34)
PREPROC_LVDS_13_P: SoM-Connectors (M2.151), Backplane-Connector (J1.A33)
PREPROC_LVDS_14_N: SoM-Connectors (M2.159), Backplane-Connector (J1.A30)
PREPROC_LVDS_14_P: SoM-Connectors (M2.157), Backplane-Connector (J1.A29)
PREPROC_LVDS_15_N: SoM-Connectors (M2.165), Backplane-Connector (J1.B40)
PREPROC_LVDS_15_P: SoM-Connectors (M2.163), Backplane-Connector (J1.B39)
PREPROC_LVDS_SSCLK_N: SoM-Connectors (M2.132), Backplane-Connector (C59.2 R79.2)
PREPROC_LVDS_SSCLK_P: SoM-Connectors (M2.130), Backplane-Connector (C37.2 R61.2)
PROC_LVDS_0_N: SoM-Connectors (M2.77), Backplane-Connector (J1.A77)
PROC_LVDS_0_P: SoM-Connectors (M2.75), Backplane-Connector (J1.A76)
PROC_LVDS_1_N: Backplane-Connector (J1.A74), HDMI (IC9.16 R15.2)
PROC_LVDS_1_P: Backplane-Connector (J1.A73), HDMI (IC9.15 R11.2)
PROC_LVDS_2_N: Backplane-Connector (J1.A71), HDMI (IC9.14 R70.2)
PROC_LVDS_2_P: Backplane-Connector (J1.A70), HDMI (IC9.13 R68.2)
PROC_LVDS_3_N: Backplane-Connector (J1.A68), HDMI (IC9.12 R74.2)
PROC_LVDS_3_P: Backplane-Connector (J1.A67), HDMI (IC9.11 R72.2)
PROC_LVDS_4_SSCLK_N: Backplane-Connector (J1.A65), HDMI (IC9.10 R78.2)
PROC_LVDS_4_SSCLK_P: Backplane-Connector (J1.A64), HDMI (IC9.9 R76.2)
PROC_LVDS_5_N: SoM-Connectors (M2.99), Backplane-Connector (J1.A62)
PROC_LVDS_5_P: SoM-Connectors (M2.97), Backplane-Connector (J1.A61)
PROC_LVDS_6_N: SoM-Connectors (M2.103), Backplane-Connector (J1.A59)
PROC_LVDS_6_P: SoM-Connectors (M2.101), Backplane-Connector (J1.A58)
PROC_LVDS_7_N: SoM-Connectors (M2.109), Backplane-Connector (J1.A53)
PROC_LVDS_7_P: SoM-Connectors (M2.107), Backplane-Connector (J1.A52)
PROC_LVDS_8_N: SoM-Connectors (M2.113), Backplane-Connector (J1.A50)
PROC_LVDS_8_P: SoM-Connectors (M2.111), Backplane-Connector (J1.A49)
PROC_LVDS_9_N: SoM-Connectors (M2.119), Backplane-Connector (J1.A47)
PROC_LVDS_9_P: SoM-Connectors (M2.117), Backplane-Connector (J1.A46)
PROC_LVDS_SSCLK_N: SoM-Connectors (M2.125), Backplane-Connector (J1.A56)
PROC_LVDS_SSCLK_P: SoM-Connectors (M2.123), Backplane-Connector (J1.A55)
PS_POR#: SoM-Connectors (M1.132), Interfaces (C21.2 POR.3 POR.4)
PS_SRST#: SoM-Connectors (M1.124), Interfaces (C22.2 R54.2 RST.3 RST.4)
PWR_GOOD: SoM-Connectors (M1.12), Interfaces (LED4.A)
S3_P2_N: SoM-MGTH (M3.97), Sensor-Connector (J2.38)
S3_P2_P: SoM-MGTH (M3.95), Sensor-Connector (J2.36)
SDIO_CD#: SoM-Connectors (M1.98), Interfaces (J4.9 R20.1)
SDIO_CLK: SoM-Connectors (M1.91), Interfaces (D6.11 J4.5 R47.1)
SDIO_CMD: SoM-Connectors (M1.93), Interfaces (D6.12 J4.3 R49.1)
SDIO_D0: SoM-Connectors (M1.95), Interfaces (D6.9 J4.7 R43.1)
SDIO_D1: SoM-Connectors (M1.97), Interfaces (D6.8 J4.8 R42.1)
SDIO_D2: SoM-Connectors (M1.101), Interfaces (D6.14 J4.1 R51.1)
SDIO_D3: SoM-Connectors (M1.103), Interfaces (D6.13 J4.2 R50.1)
SPI_S1_CLK: SoM-MGTH (M3.166), Sensor-Connector (J2.97)
SPI_S1_CS: SoM-MGTH (M3.164), Sensor-Connector (J2.95)
SPI_S1_MISO: SoM-MGTH (M3.160), Sensor-Connector (J2.89)
SPI_S1_MOSI: SoM-MGTH (M3.162), Sensor-Connector (J2.91)
SPI_S2_CLK: Backplane-Connector (R57.1), Sensor-Connector (J2.16)
SPI_S2_CS: Backplane-Connector (R60.1), Sensor-Connector (J2.18)
SPI_S2_MISO: Backplane-Connector (R46.1), Sensor-Connector (J2.6)
SPI_S2_MOSI: Backplane-Connector (R44.1), Sensor-Connector (J2.4)
SYS_RES_N_S1: SoM-MGTH (M3.99), Sensor-Connector (J2.44)
SYS_RES_N_S2: SoM-MGTH (M3.91), Sensor-Connector (J2.23)
T_EXP1_S1: SoM-MGTH (M3.71), Sensor-Connector (J2.109)
T_EXP1_S2: SoM-MGTH (M3.74), Sensor-Connector (J2.115)
T_EXP2_S1: SoM-MGTH (M3.69), Sensor-Connector (J2.111)
T_EXP2_S2: SoM-MGTH (M3.72), Sensor-Connector (J2.113)
UART_RX: SoM-Connectors (M1.105), Debug (R35.1)
UART_TX: SoM-Connectors (M1.107), Debug (R91.1)
US_HDMI_CLK_N: SoM-MGTH (M3.153), HDMI (C17.1)
US_HDMI_CLK_P: SoM-MGTH (M3.151), HDMI (C16.1)
US_HDMI_D0_N: SoM-MGTH (M3.163), HDMI (C32.1)
US_HDMI_D0_P: SoM-MGTH (M3.161), HDMI (C31.1)
US_HDMI_D1_N: SoM-MGTH (M3.159), HDMI (C79.1)
US_HDMI_D1_P: SoM-MGTH (M3.157), HDMI (C34.1)
US_HDMI_D2_N: SoM-MGTH (M3.147), HDMI (C81.1)
US_HDMI_D2_P: SoM-MGTH (M3.145), HDMI (C80.1)
US_PROC_LVDS_1_N: SoM-Connectors (M2.83), HDMI (C85.1 R14.1)
US_PROC_LVDS_1_P: SoM-Connectors (M2.81), HDMI (C84.1 R10.1)
US_PROC_LVDS_2_N: SoM-Connectors (M2.89), HDMI (C87.1 R69.1)
US_PROC_LVDS_2_P: SoM-Connectors (M2.87), HDMI (C86.1 R67.1)
US_PROC_LVDS_3_N: SoM-Connectors (M2.93), HDMI (C89.1 R73.1)
US_PROC_LVDS_3_P: SoM-Connectors (M2.91), HDMI (C88.1 R71.1)
US_PROC_LVDS_4_SSCLK_N: SoM-Connectors (M2.59), HDMI (C91.1 R75.1)
US_PROC_LVDS_4_SSCLK_P: SoM-Connectors (M2.57), HDMI (C90.1 R77.1)
USB_D_N: SoM-Connectors (M1.129), Interfaces (L3.1)
USB_D_P: SoM-Connectors (M1.127), Interfaces (L3.2)
USB_ID: SoM-Connectors (M1.133), Interfaces (R18.1)
USB_SS_RX_N: SoM-Connectors (M2.36), Interfaces (L4.3)
USB_SS_RX_P: SoM-Connectors (M2.32), Interfaces (L4.4)
USB_SS_TX_N: SoM-Connectors (M2.33), Interfaces (L5.1)
USB_SS_TX_P: SoM-Connectors (M2.29), Interfaces (L5.2)

## Assembly variants
Production: not fitted C12 C13 C19 C20 C23 C33 C36 C37 C59 C60 C61 C62 C63 C66 C67 C82 C83 C84 C85 C86 C87 C88 C89 C90 C91 FAN IC5 IC9 R63 R64 R65 R66 R89 R97 R99 R100 R101 R102 R103 R104 R105 R106 R108 R110
Axiom: not fitted FAN1 R44 R46 R48 R56 R57 R60 R61 R79 R80 R81 R82 R83 R84 R85 R86 R87